# Altium schematic sheet Safety_2019_V_3_0_Faults.SchDoc
size A
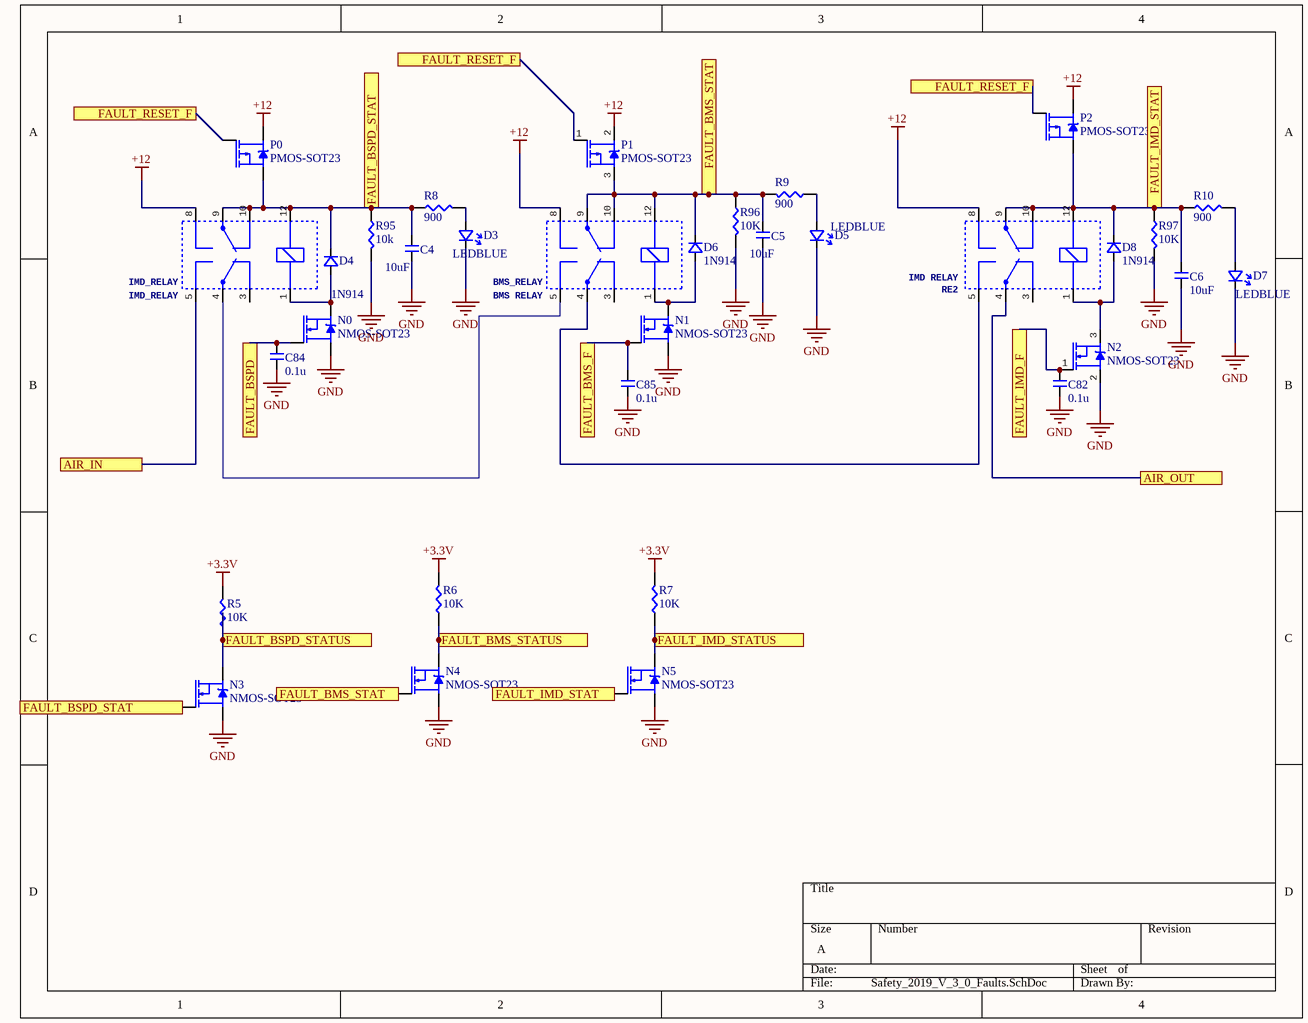
[diagram p0: Safety_2019_V_3_0_Faults.SchDoc]

## Parts
BMS_RELAY  BMS RELAY  [RELAY-DPDT_EC2]
C4  10uF  [CAP-0603]
C5  10uF  [CAP-0603]
C6  10uF  [CAP-0603]
C82  0.1u  [CAP-0603]
C84  0.1u  [CAP-0603]
C85  0.1u  [CAP-0603]
D3  LEDBLUE  [LEDBLUE-0603]
D4  1N914  [DO41-10]
D5  LEDBLUE  [LEDBLUE-0603]
D6  1N914  [DO41-10]
D7  LEDBLUE  [LEDBLUE-0603]
D8  1N914  [DO41-10]
IMD_RELAY  IMD_RELAY  [RELAY-DPDT_EC2]
N0  NMOS-SOT23  [SOT23]
N1  NMOS-SOT23  [SOT23]
N2  NMOS-SOT23  [SOT23]
N3  NMOS-SOT23  [SOT23]
N4  NMOS-SOT23  [SOT23]
N5  NMOS-SOT23  [SOT23]
P0  PMOS-SOT23  [SOT23]
P1  PMOS-SOT23  [SOT23]
P2  PMOS-SOT23  [SOT23]
R5  10K  [RES-0603]
R6  10K  [RES-0603]
R7  10K  [RES-0603]
R8  900  [RES-0603]
R9  900  [RES-0603]
R10  900  [RES-0603]
R95  10k  [RES-0603]
R96  10K  [RES-0603]
R97  10K  [RES-0603]
RE2  IMD RELAY  [RELAY-DPDT_EC2]

## Ports
AIR_IN, AIR_OUT, FAULT_BMS_F, FAULT_BMS_STAT, FAULT_BMS_STATUS, FAULT_BSPD, FAULT_BSPD_STAT, FAULT_BSPD_STATUS, FAULT_IMD_F, FAULT_IMD_STAT, FAULT_IMD_STATUS, FAULT_RESET_F

## Nets
+3.3V: R5.2 R6.2 R7.2
+12: BMS_RELAY.8 IMD_RELAY.8 P0.2(S) P1.2(S) P2.2(S) RE2.8
GND: C4.2 C5.2 C6.2 C82.1 C84.1 C85.1 D3.K D5.K D7.K N0.2(S) N1.2(S) N2.2(S) N3.2(S) N4.2(S) N5.2(S) R95.2 R96.2 R97.2
AIR_IN: IMD_RELAY.5 ; port AIR_IN
AIR_OUT: RE2.4 ; port AIR_OUT
FAULT_BMS_F: C85.2 N1.1(G) ; port FAULT_BMS_F
FAULT_BMS_STAT: BMS_RELAY.9 BMS_RELAY.10 BMS_RELAY.12 C5.1 D6.K N4.1(G) P1.3(D) R9.2 R96.1 ; port FAULT_BMS_STAT
FAULT_BMS_STATUS: N4.3(D) R6.1 ; port FAULT_BMS_STATUS
FAULT_BSPD: C84.2 N0.1(G) ; port FAULT_BSPD
FAULT_BSPD_STAT: C4.1 D4.K IMD_RELAY.9 IMD_RELAY.10 IMD_RELAY.12 N3.1(G) P0.3(D) R8.1 R95.1 ; port FAULT_BSPD_STAT
FAULT_BSPD_STATUS: N3.3(D) R5.1 ; port FAULT_BSPD_STATUS
FAULT_IMD_F: C82.2 N2.1(G) ; port FAULT_IMD_F
FAULT_IMD_STAT: C6.1 D8.K N5.1(G) P2.3(D) R10.1 R97.1 RE2.9 RE2.10 RE2.12 ; port FAULT_IMD_STAT
FAULT_IMD_STATUS: N5.3(D) R7.1 ; port FAULT_IMD_STATUS
FAULT_RESET_F: P0.1(G) P1.1(G) P2.1(G) ; port FAULT_RESET_F
NetBMS_RELAY_1: BMS_RELAY.1 D6.A N1.3(D)
NetBMS_RELAY_4: BMS_RELAY.4 RE2.5
NetBMS_RELAY_5: BMS_RELAY.5 IMD_RELAY.4
NetD3_A: D3.A R8.2
NetD4_A: D4.A IMD_RELAY.1 N0.3(D)
NetD5_A: D5.A R9.1
NetD7_A: D7.A R10.2
NetD8_A: D8.A N2.3(D) RE2.1

Not connected (* = marked no-connect by the designer): BMS_RELAY 3; IMD_RELAY 3; RE2 3

## Library data of the parts
BMS_RELAY IMD_RELAY RE2 = RELAY_EC2: GateName_1: G$1; SymbolName_1: MONOSTABLERELAY; DeviceSetName: EC2; LibraryName: KEMET; Package: DPDT_2.54
C4-C6 C82 C84 C85 = CAP-0603
D3 D5 D7 = LEDBLUE-0603
D4 D6 D8 = DIODE-DO41-10
R5-R10 R95-R97 = RES-0603